# EAGLE design button (EAGLE 7.5.0)

## Sheet 1 of 3: MAIN
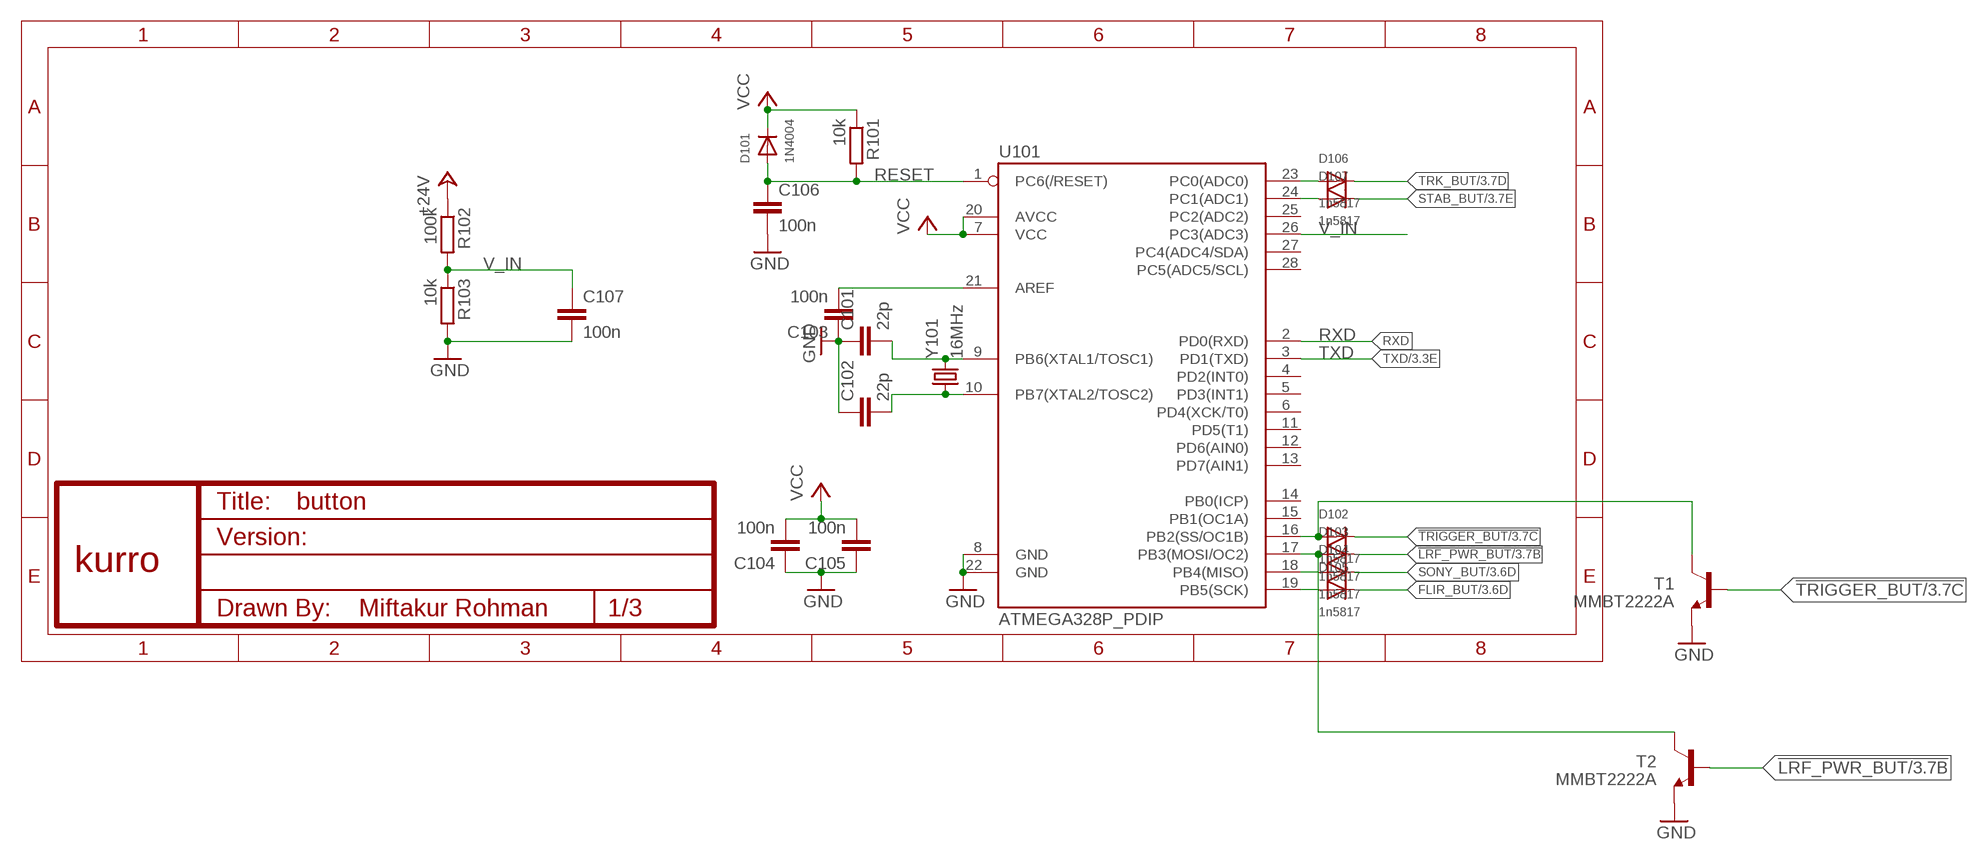
[diagram p0: schematic, sheet 1]

### Parts
C101  22p  C-EUC0603  [C0603]
C102  22p  C-EUC0603  [C0603]
C103  100n  C-EUC0603  [C0603]
C104  100n  C-EUC0603  [C0603]
C105  100n  C-EUC0603  [C0603]
C106  100n  C-EUC0603  [C0603]
C107  100n  C-EUC0603  [C0603]
D101  1N4004  DIODESOD-323F  [SOD-323F]
D102  1n5817  DIODESOD-323F  [SOD-323F]
D103  1n5817  DIODESOD-323F  [SOD-323F]
D104  1n5817  DIODESOD-323F  [SOD-323F]
D105  1n5817  DIODESOD-323F  [SOD-323F]
D106  1n5817  DIODESOD-323F  [SOD-323F]
D107  1n5817  DIODESOD-323F  [SOD-323F]
R101  10k  R-EU_R0603  [R0603]
R102  100k  R-EU_R0603  [R0603]
R103  10k  R-EU_R0603  [R0603]
T1  MMBT2222A  TRANSISTOR_NPNSOT23  [SOT23]
T2  MMBT2222A  TRANSISTOR_NPNSOT23  [SOT23]
U101  ATMEGA328P_PDIP  [DIL28-3]
U$1  KURRO_FOOTPRINT  [KURRO-LOGO]
Y101  16MHz  CRYSTAL-TXC-7A2  [CRYSTAL-TXC-7A2]

### Nets
!LRF_PWR_BUT: D103.C T2.1(B) ; also sheet 3
!TRIGGER_BUT: D102.C T1.1(B) ; also sheet 3
+24V [power]: R102.1 ; also sheet 2,3
FLIR_BUT: D105.C ; also sheet 3
GND: C101.1 C102.1 C103.1 C104.1 C105.1 C106.2 C107.2 R103.2 T1.2(E) T2.2(E) U101.8(GND) U101.22(GND) ; also sheet 2,3
N$7: D104.A U101.18(PB4(MISO))
N$8: D105.A U101.19(PB5(SCK))
N$9: D103.A T2.3(C) U101.17(PB3(MOSI/OC2))
N$10: D106.A U101.23(PC0(ADC0))
N$11: D107.A U101.24(PC1(ADC1))
N$12: D102.A T1.3(C) U101.16(PB2(SS/OC1B))
N$63: C101.2 U101.9(PB6(XTAL1/TOSC1)) Y101.P$2
N$64: C102.2 U101.10(PB7(XTAL2/TOSC2)) Y101.P$1
N$65: C103.2 U101.21(AREF)
RESET: C106.1 D101.A R101.2 U101.1(PC6(/RESET))
RXD: U101.2(PD0(RXD))
SONY_BUT: D104.C ; also sheet 3
STAB_BUT: D107.C ; also sheet 3
TRK_BUT: D106.C ; also sheet 3
TXD: U101.3(PD1(TXD)) ; also sheet 3
V_IN: C107.1 R102.2 R103.1 U101.26(PC3(ADC3))
VCC: C104.2 C105.2 D101.C R101.1 U101.7(VCC) U101.20(AVCC) ; also sheet 2
Unconnected: U101.4(PD2(INT0)) U101.5(PD3(INT1)) U101.6(PD4(XCK/T0)) U101.11(PD5(T1)) U101.12(PD6(AIN0)) U101.13(PD7(AIN1)) U101.14(PB0(ICP)) U101.15(PB1(OC1A)) U101.25(PC2(ADC2)) U101.27(PC4(ADC4/SDA)) U101.28(PC5(ADC5/SCL))

## Sheet 2 of 3: PSU
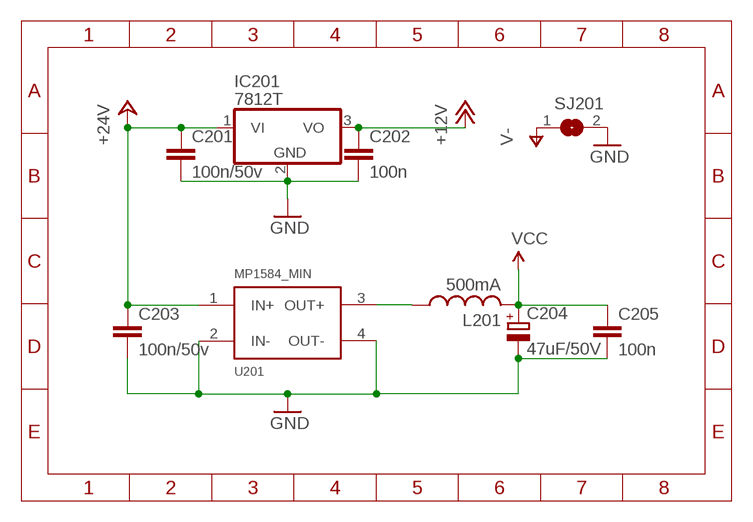
[diagram p1: schematic, sheet 2]

### Parts
C201  100n/50v  C-EUC0603  [C0603]
C202  100n  C-EUC0603  [C0603]
C203  100n/50v  C-EUC0603  [C0603]
C204  47uF/50V  CPOL-EUE2.5-7  [E2,5-7]
C205  100n  C-EUC0603  [C0603]
IC201  7812T  [TO220H]
L201  500mA  L-USL1812  [L1812]
SJ201  SJ  [SJ]
U201  MP1584_MIN  [MP1584_MIN]

### Nets
+12V: C202.1 IC201.3(VO) ; also sheet 3
+24V [power]: C201.1 C203.1 IC201.1(VI) U201.1(IN+) ; also sheet 1,3
GND: C201.2 C202.2 C203.2 C204.- C205.2 IC201.2(GND) SJ201.2 U201.2(IN-) U201.4(OUT-) ; also sheet 1,3
N$1: L201.1 U201.3(OUT+)
V- [power]: SJ201.1 ; also sheet 3
VCC: C204.+ C205.1 L201.2 ; also sheet 1

## Sheet 3 of 3: CONNECTOR
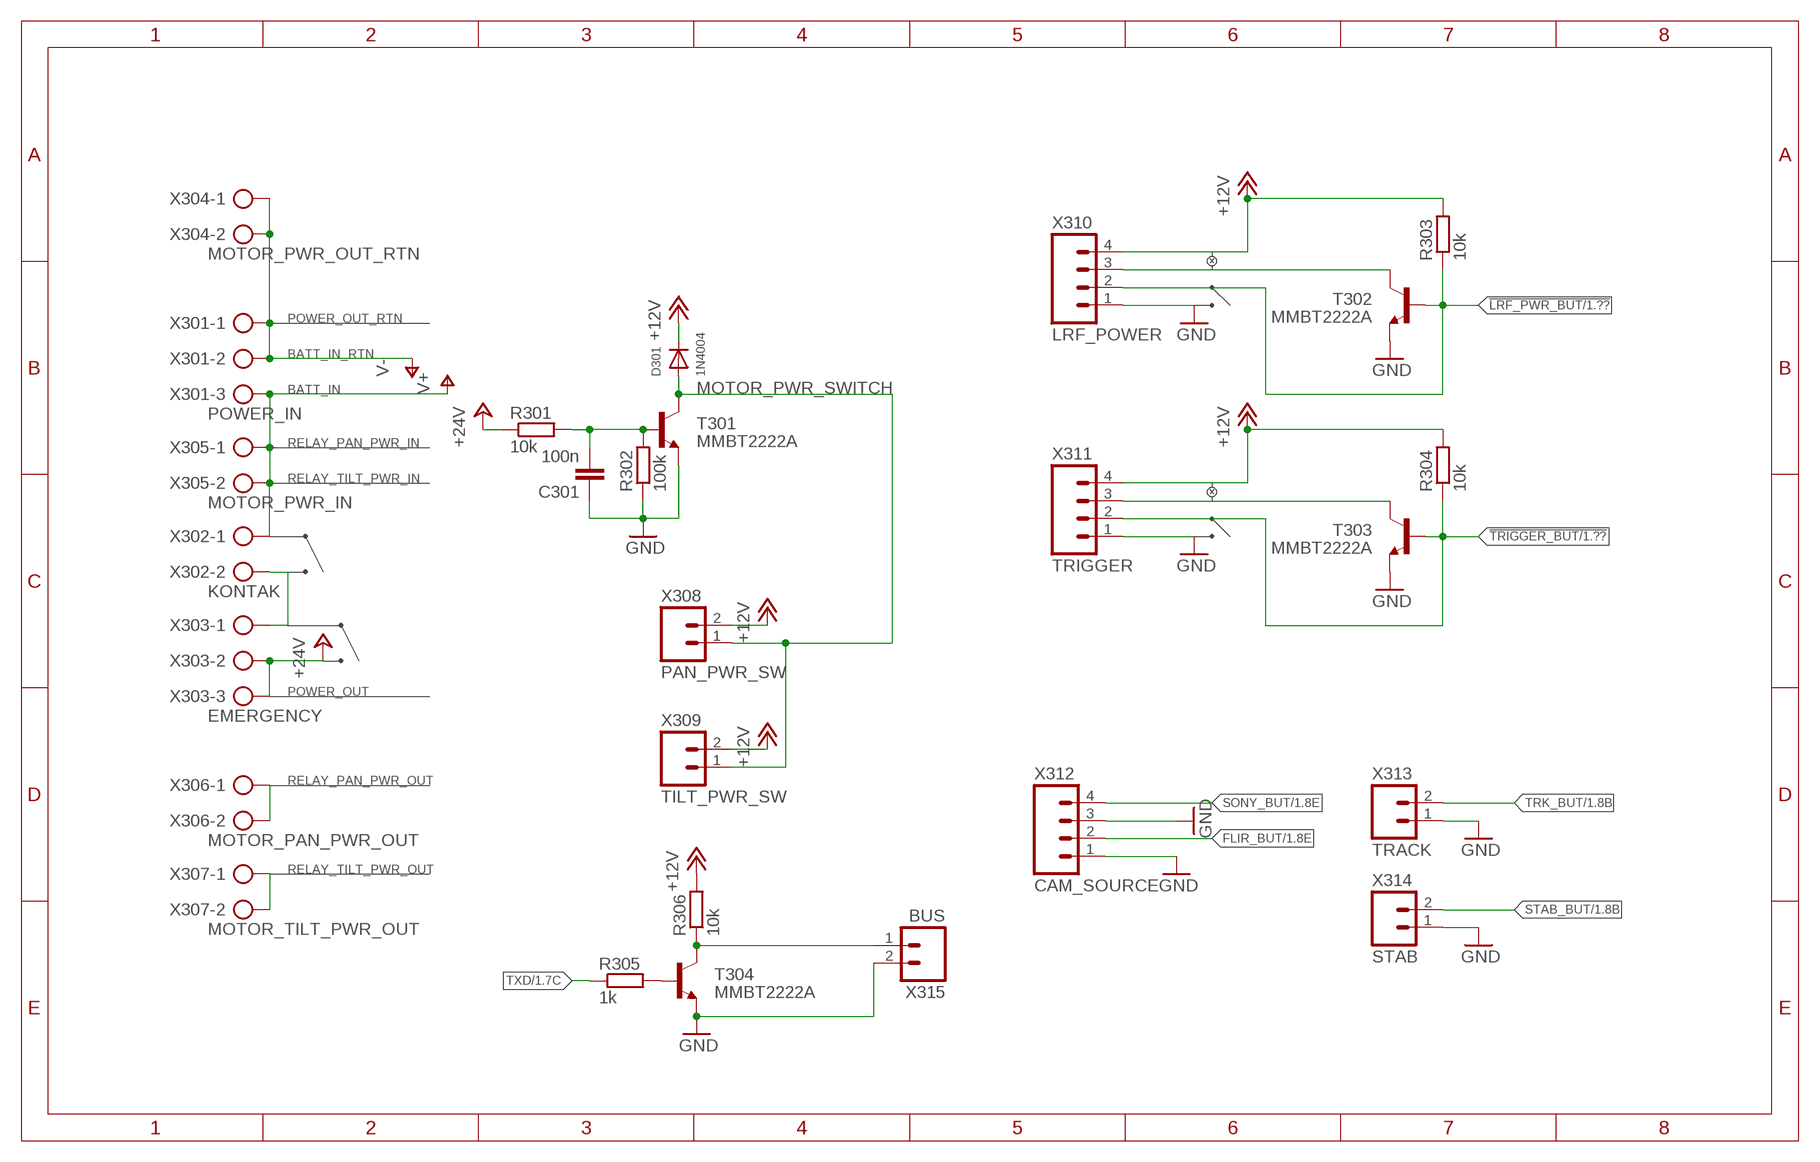
[diagram p2: schematic, sheet 3]

### Parts
C301  100n  C-EUC0603  [C0603]
D301  1N4004  DIODESOD-323F  [SOD-323F]
R301  10k  R-EU_R0603  [R0603]
R302  100k  R-EU_R0603  [R0603]
R303  10k  R-EU_R0603  [R0603]
R304  10k  R-EU_R0603  [R0603]
R305  1k  R-EU_R0603  [R0603]
R306  10k  R-EU_R0603  [R0603]
T301  MMBT2222A  TRANSISTOR_NPNSOT23  [SOT23]
T302  MMBT2222A  TRANSISTOR_NPNSOT23  [SOT23]
T303  MMBT2222A  TRANSISTOR_NPNSOT23  [SOT23]
T304  MMBT2222A  TRANSISTOR_NPNSOT23  [SOT23]
X301  POWER_IN  AK300/3  [AK300/3]
X302  KONTAK  AK300/2  [AK300/2]
X303  EMERGENCY  AK300/3  [AK300/3]
X304  MOTOR_PWR_OUT_RTN  AK300/2  [AK300/2]
X305  MOTOR_PWR_IN  AK300/2  [AK300/2]
X306  MOTOR_PAN_PWR_OUT  AK300/2  [AK300/2]
X307  MOTOR_TILT_PWR_OUT  AK300/2  [AK300/2]
X308  PAN_PWR_SW  M02JST-PTH-VERT  [JST-2-PTH-VERT]
X309  TILT_PWR_SW  M02JST-PTH-VERT  [JST-2-PTH-VERT]
X310  LRF_POWER  M04JST-PTH-VERT  [JST-4-PTH-VERT]
X311  TRIGGER  M04JST-PTH-VERT  [JST-4-PTH-VERT]
X312  CAM_SOURCE  M04JST-PTH-VERT  [JST-4-PTH-VERT]
X313  TRACK  M02JST-PTH-VERT  [JST-2-PTH-VERT]
X314  STAB  M02JST-PTH-VERT  [JST-2-PTH-VERT]
X315  BUS  M02JST-PTH-VERT  [JST-2-PTH-VERT]

### Nets
!LRF_PWR_BUT: R303.1 T302.1(B) X310.2 ; also sheet 1
!TRIGGER_BUT: R304.1 T303.1(B) X311.2 ; also sheet 1
+12V: D301.C R303.2 R304.2 R306.2 X308.2 X309.2 X310.4 X311.4 ; also sheet 2
+24V [power]: R301.1 X303.2 X303.3 ; also sheet 1,2
BUS1: R306.1 T304.3(C) X315.1
FLIR_BUT: X312.2 ; also sheet 1
GND: C301.1 R302.1 T301.2(E) T302.2(E) T303.2(E) T304.2(E) X310.1 X311.1 X312.1 X312.3 X313.1 X314.1 X315.2 ; also sheet 1,2
KONTAK_EMER_JUNCTION [power]: X302.2 X303.1
MOTOR_PWR_SWITCH: D301.A T301.3(C) X308.1 X309.1
N$2: C301.2 R301.2 R302.2 T301.1(B)
N$3 [power]: X306.1 X306.2
N$4 [power]: X307.1 X307.2
N$5: T303.3(C) X311.3
N$6: T302.3(C) X310.3
N$15: R305.2 T304.1(B)
SONY_BUT: X312.4 ; also sheet 1
STAB_BUT: X314.2 ; also sheet 1
TRK_BUT: X313.2 ; also sheet 1
TXD: R305.1 ; also sheet 1
V+ [power]: X301.3 X302.1 X305.1 X305.2
V- [power]: X301.1 X301.2 X304.1 X304.2 ; also sheet 2

### Notes on the sheet
- POWER_OUT_RTN
- BATT_IN_RTN
- BATT_IN
- RELAY_PAN_PWR_IN
- RELAY_TILT_PWR_IN
- POWER_OUT
- RELAY_PAN_PWR_OUT
- RELAY_TILT_PWR_OUT

## Library data of the parts
C101-C107 C201-C203 C205 C301 = rcl:C-EU: CAPACITOR, European symbol
C204 = rcl:CPOL-EU: POLARIZED CAPACITOR, European symbol
D101-D107 D301 = adafruit:DIODE: Diode SMADIODE - SMA Surface Mount Package 20V 1A Schottky Diode Digikey: 641-1014-6-ND DO-1N4148 - Through Hole Small Current Diode SOD-123 20V 1 A (.5mV Vf) Schottky Diode - Digikey: MBRX120TPMSCT-ND SOD-323 10V 570mA (.38mV Vf, 3ns) Schottky Diode - Digikey: ZLLS410CT-ND SOD-523 30V 30mA Schottky Diode (RB751S-40TE61) - Digikey: RB751S-40TE61CT-ND SOT23-R/W - SOT23 Package (R = Solder Paste/Reflow Ovens, W = Hand-Soldering) BAT54Film 40V 300mA - Digikey: 497-7162-1-ND
IC201 = adafruit:78*: Positive VOLTAGE REGULATOR Added bigger pads to the TO-92 package
L201 = rcl:L-US: INDUCTOR, American symbol
R101-R103 R301-R306 = rcl:R-EU_: RESISTOR, European symbol
SJ201 = jumper:SJ: SMD solder JUMPER
T1 T2 T301-T304 = SparkFun-DiscreteSemi:TRANSISTOR_NPN: Generic NPN BJT MMBT2222A - TRANS-08049 (SOT-23, 1A 40V) MPSA42 - TRANS-09116 (SOT-23, 500mA 300V) MMBT5088LT1G - TRANS-11160 (SOT-23, 50 mA 30V)
U101 = SparkFun-DigitalIC:ATMEGA328P_PDIP: uC used in the Arduino 32kb flash, 1k EEPROM, 2k SRAM This is the through-hole version of this chip.
U201 = SparkFun-Boards:MP1584
U$1 = SparkFun:KURRO_FOOTPRINT
X301 X303 = con-ptr500:AK300/3: CONNECTOR; OC_FARNELL: unknown; OC_NEWARK: unknown
X302 X304-X307 = con-ptr500:AK300/2: CONNECTOR; OC_FARNELL: unknown; OC_NEWARK: unknown
X308 X309 X313-X315 = SparkFun-Connectors:M02: Standard 2-pin 0.1" header. Use with - straight break away headers ( PRT-00116) - right angle break away headers (PRT-00553) - swiss pins (PRT-00743) - machine pins (PRT-00117) - female headers (PRT-00115) Molex polarized connector foot print use with: PRT-08233 with associated crimp pins and housings. 2.54_SCREWTERM for use with PRT-10571. 3.5mm Screw Terminal footprints for PRT-08084 5mm Screw Terminal footprints for use with PRT-08433
X310-X312 = SparkFun-Connectors:M04: Header 4 Standard 4-pin 0.1" header. Use with straight break away headers (SKU : PRT-00116), right angle break away headers (PRT-00553), swiss pins (PRT-00743), machine pins (PRT-00117), and female headers (PRT-00115). Molex polarized connector foot print use with SKU : PRT-08231 with associated crimp pins and housings. 1MM SMD Version SKU: PRT-10208
Y101 = SparkFun-FreqCtrl:CRYSTAL: Various standard crystals. Proven footprints.

## Net classes
0 default: width 0.254 mm, drill 0.59 mm, clearance 0.254 mm
1 power: width 0.406 mm, drill 0.8 mm, clearance 0.406 mm

## Board
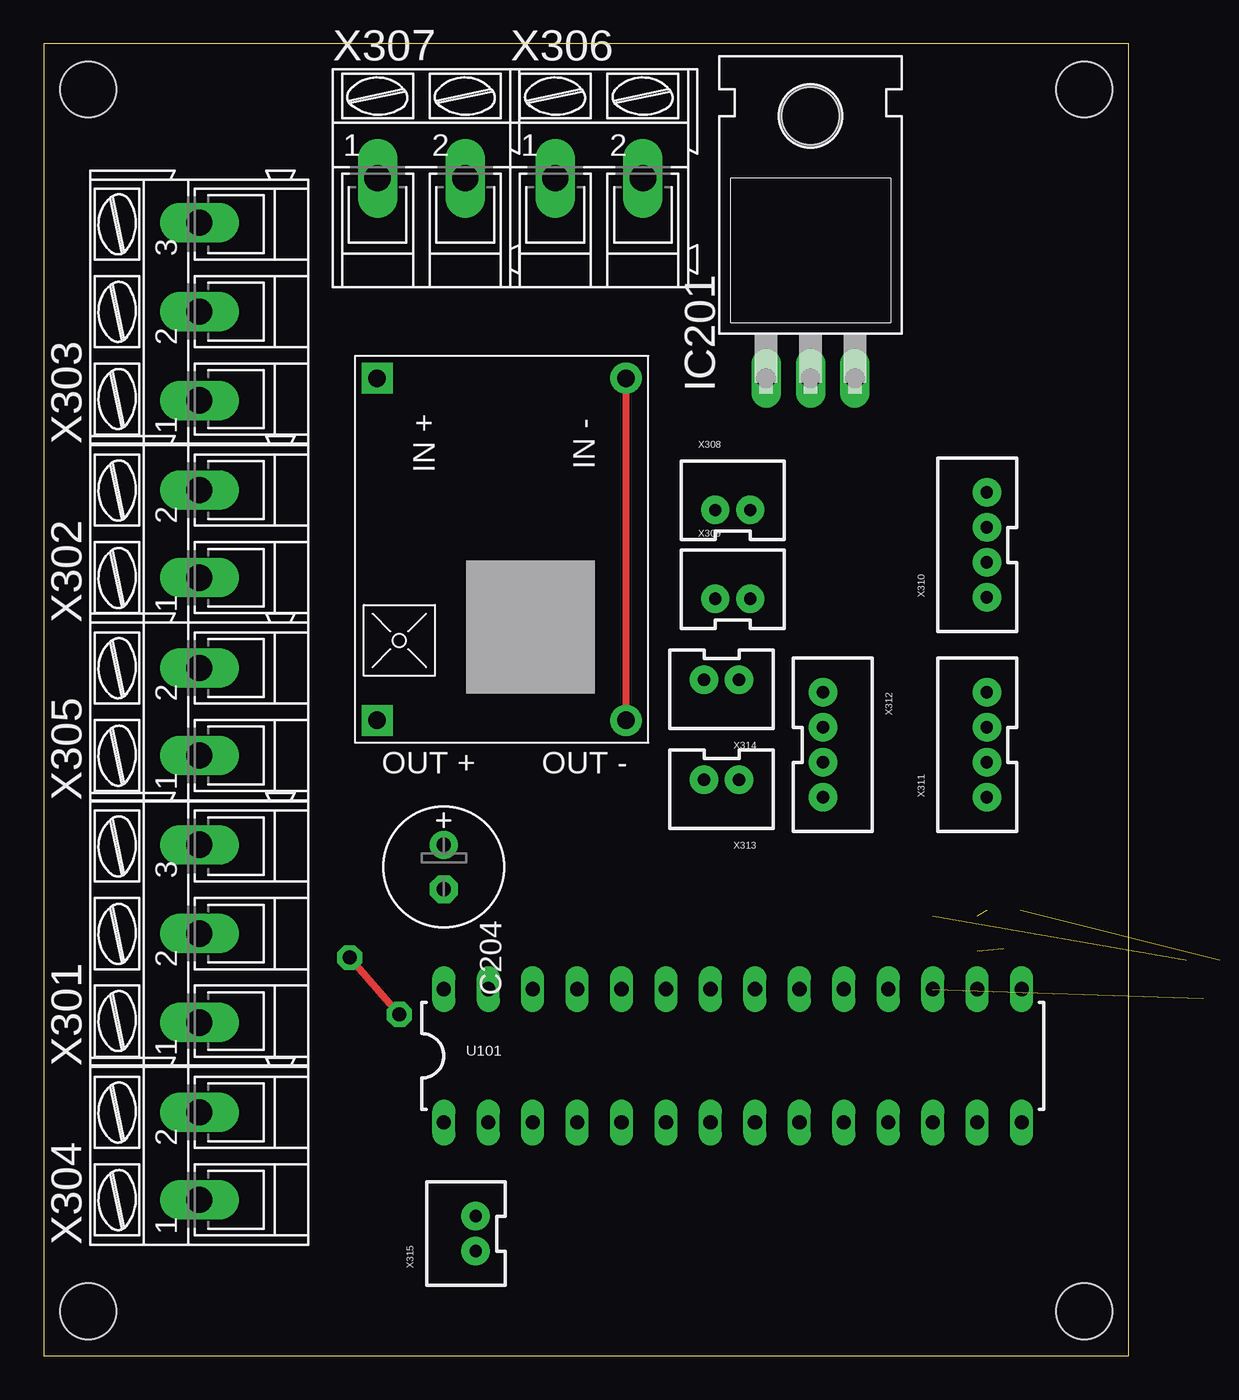
[diagram p3: board, top side]
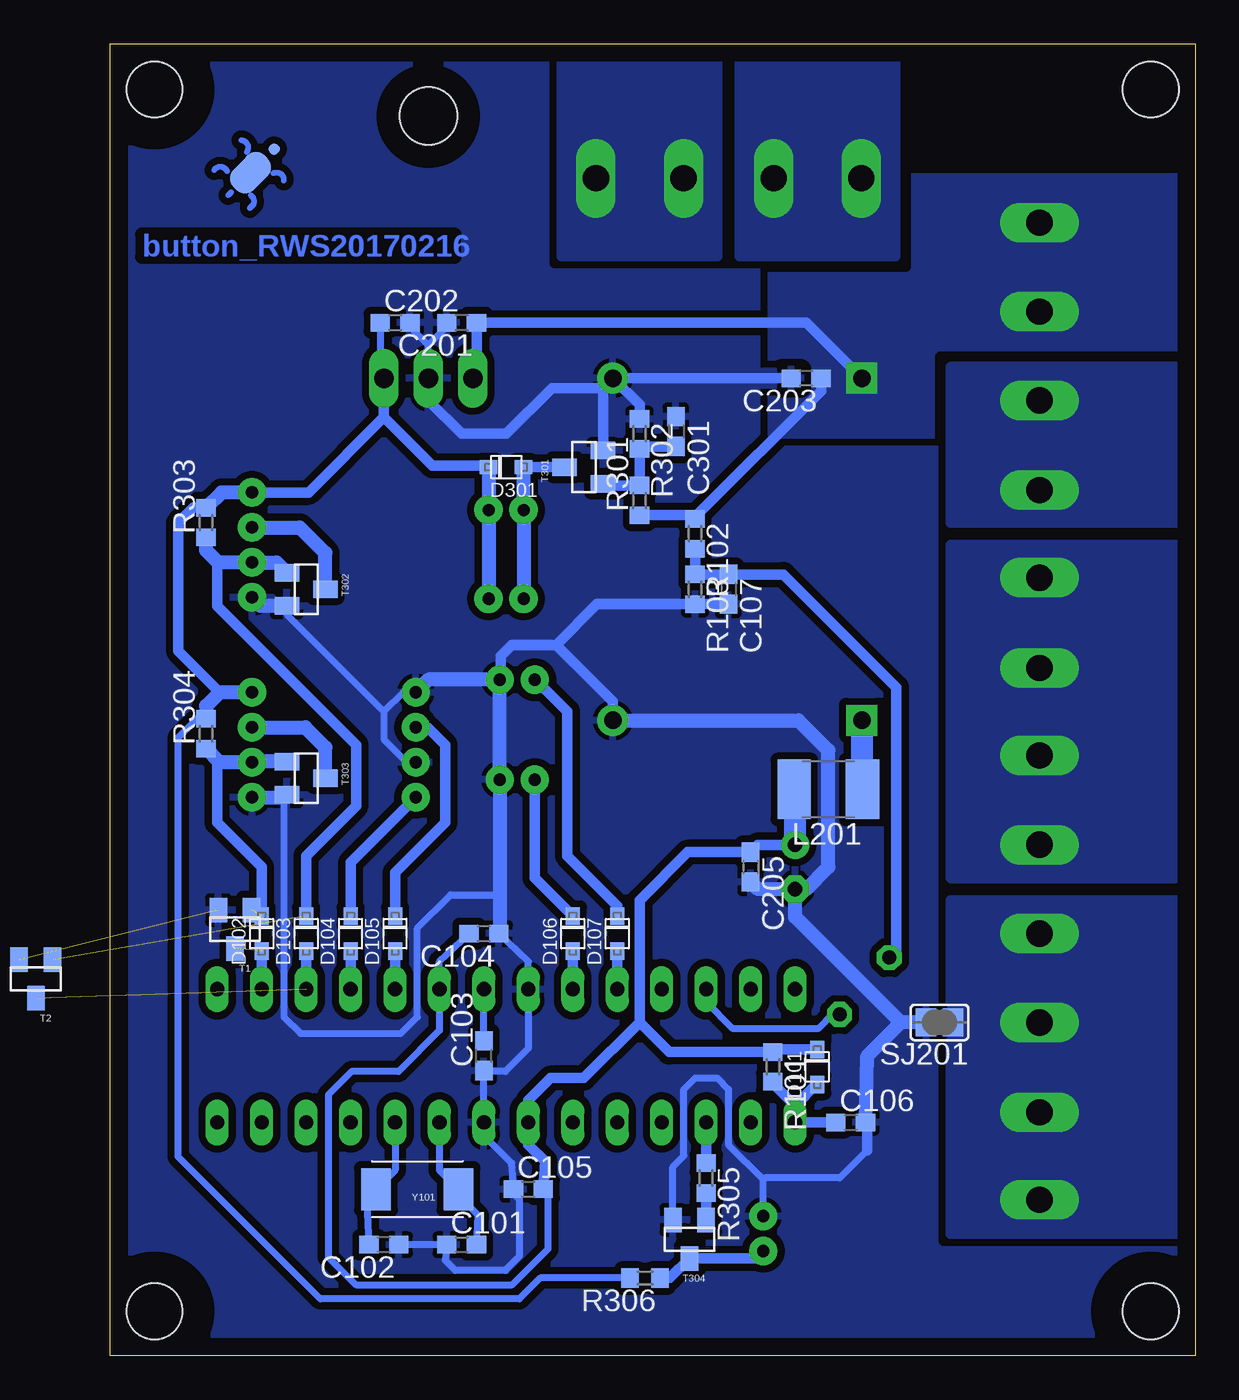
[diagram p4: board, bottom side, seen from below]

Size 62 x 75 mm. Coordinates in mm from the lower left corner, seen from the top.
Outline: 0,0 62,0 62,75 0,75 0,0
Copper layers (1*16): Top 0.035mm / dielectric 1.5mm / Bottom 0.035mm
Design rules "default": minimum track width 10mil, minimum drill 24mil, track to track 8mil, track to pad 8mil, pad to pad 8mil, via to via 8mil, smd to smd 8mil, copper to edge 40mil, drill to drill 8mil, minimum pad ring 10mil, minimum via ring 8mil, stop-mask expansion 4mil, vias tented up to drill 0mil, thermal gap 10mil
Holes 3.2 mm at 2.54,2.54 2.54,72.39 59.46,2.54 59.46,72.39
bRestrict: area -0.5,-0.5 to 5.5,5.5; area -0.5,69.4 to 5.5,75.4; area 56.5,-0.5 to 62.5,5.5; area 56.5,69.4 to 62.5,75.4

### Footprints (pad centres in the part's own frame; a part is rotated, then mirrored left to right if it is on the bottom)
C0603 = smd 1.1 x 1: 1 -0.85,0; 2 0.85,0
E2,5-7 = drill 0.813 pad 1.6: + -1.27,0 | drill 0.813 pad 1.6 octagon: - 1.27,0
SOD-323F = smd 1 x 0.8: A -1,0; C 1,0
TO220H = drill 1.118 long: 1 -2.54,-10.16; 2 0,-10.16; 3 2.54,-10.16 | hole 3.302: 0,4.826
L1812 = smd 1.9 x 3.4: 1 -1.95,0; 2 1.95,0
R0603 = smd 1 x 1.1: 1 -0.85,0; 2 0.85,0
SJ = smd 1.168 x 1.6: 1 -0.762,0; 2 0.762,0
SOT23 = smd 1 x 1.4: 1 -0.95,-1.1; 2 0.95,-1.1; 3 0,1.1
DIL28-3 = drill 0.813 long: 1 -16.51,-3.81; 2 -13.97,-3.81; 3 -11.43,-3.81; 4 -8.89,-3.81; 5 -6.35,-3.81; 6 -3.81,-3.81; 7 -1.27,-3.81; 8 1.27,-3.81; 9 3.81,-3.81; 10 6.35,-3.81; 11 8.89,-3.81; 12 11.43,-3.81; 13 13.97,-3.81; 14 16.51,-3.81; 15 16.51,3.81; 16 13.97,3.81; 17 11.43,3.81; 18 8.89,3.81; 19 6.35,3.81; 20 3.81,3.81; 21 1.27,3.81; 22 -1.27,3.81; 23 -3.81,3.81; 24 -6.35,3.81; 25 -8.89,3.81; 26 -11.43,3.81; 27 -13.97,3.81; 28 -16.51,3.81
MP1584_MIN = drill 1 pad 1.778 square: 1 1.27,1.27; 3 20.83,1.27 | drill 1 pad 1.778: 2 1.27,15.49; 4 20.83,15.49
KURRO-LOGO = smd 2.54 x 1.651 rotated 45 bottom: P$1 0,0 | smd 0.635 x 0.635 rotated 45 bottom: P$2 1.347,1.347
AK300/3 = drill 1.5 long: 1 -5.08,0; 2 0,0; 3 5.08,0
AK300/2 = drill 1.5 long: 1 -2.515,0; 2 2.489,0
JST-2-PTH-VERT = drill 0.7 pad 1.626: 1 -1,-0.55; 2 1,-0.55
JST-4-PTH-VERT = drill 0.7 pad 1.626: 1 -3,-0.55; 2 -1,-0.55; 3 1,-0.55; 4 3,-0.55
CRYSTAL-TXC-7A2 = smd 1.7 x 2.4: P$1 2.358,0; P$2 -2.358,0

### Placement (x,y rotation side)
C101  41.91,6.35 0 bottom
C102  46.35,6.35 180 bottom
C103  40.64,17.14 90 bottom
C104  40.64,24.13 180 bottom
C105  38.1,9.53 0 bottom
C106  19.68,13.34 0 bottom
C107  26.67,43.81 270 bottom
C201  41.91,59.05 180 bottom
C202  45.72,59.05 0 bottom
C203  22.23,55.88 180 bottom
C204  22.86,27.94 270 top
C205  25.4,27.94 270 bottom
C301  29.67,52.83 270 bottom
D101  21.59,16.51 90 bottom
D102  53.34,24.13 90 bottom
D103  50.8,24.13 90 bottom
D104  48.26,24.13 90 bottom
D105  45.72,24.13 90 bottom
D106  35.56,24.13 90 bottom
D107  33.02,24.13 90 bottom
D301  39.37,50.8 180 bottom
IC201  43.81,66.04 0 top
L201  20.95,32.38 180 bottom
R101  24.13,16.51 270 bottom
R102  28.57,46.99 270 bottom
R103  28.57,43.81 270 bottom
R301  31.75,48.9 90 bottom
R302  31.75,52.7 270 bottom
R303  56.52,47.62 90 bottom
R304  56.52,35.56 90 bottom
R305  27.94,10.16 270 bottom
R306  31.43,4.45 180 bottom
SJ201  14.61,19.05 180 bottom
T1  54.86,24.38 180 bottom
T2  66.24,21.54 180 bottom  (outside the outline)
T301  34.92,50.8 90 bottom
T302  50.8,43.81 270 bottom
T303  50.8,33.02 270 bottom
T304  28.89,6.67 180 bottom
U101  39.37,17.14 0 top
U201  17.78,57.15 270 top
U$1  53.98,67.63 90 top
X301  8.89,24.13 90 top
X302  8.89,46.99 90 top
X303  8.89,59.69 90 top
X304  8.89,11.43 90 top
X305  8.89,36.83 90 top
X306  31.75,67.31 0 top
X307  21.59,67.31 0 top
X308  39.37,48.9 0 top
X309  39.37,43.81 0 top
X310  53.34,46.35 90 top
X311  53.34,34.92 90 top
X312  45.09,34.92 270 top
X313  38.73,32.38 180 top
X314  38.73,38.1 180 top
X315  24.13,6.99 90 top
Y101  44.45,9.53 180 bottom

### Tracks (layer width: path | path; a pad name or v marks a point on that pad's centre or on a via)
!LRF_PWR_BUT  (1 unrouted)
  Bottom 0.61: D103.C 50.8,28.57 47.94,31.43 47.94,34.92 55.88,42.86 55.88,45.31 55.83,45.35
  Bottom 0.813: T302.1 52.49,45.35 X310.2 55.83,45.35 56.52,46.04 R303.1
!TRIGGER_BUT  (1 unrouted)
  Bottom 0.61: D102.C 53.34,27.94 55.88,30.48 55.88,33.77 55.73,33.92
  Bottom 0.813: T303.1 53.84,33.97 X311.2 55.73,33.92 R304.1
+12V
  Bottom 0.406: C202.1 46.57,56.09 IC201.3 | R306.2 37.41,4.45 38.61,3.25 49.99,3.25 58.12,11.38 58.12,35.36 57.06,36.41 R304.2
  Bottom 0.61: IC201.3 46.35,53.66 | 46.35,53.66 43.58,50.88 40.45,50.88 D301.C | X310.4 50.66,49.35 46.35,53.66 | R303.2 57.25,48.48 58.1,47.62 58.1,40.29 55.74,37.92
  Bottom 0.813: D301.C X308.2 X309.2 | X310.4 55.63,49.35 R303.2 | X311.4 55.74,37.92 56.52,37.15 R304.2
+24V
  Bottom 0.61: C203.1 21.38,55.14 28.47,48.05 | R301.1 28.47,48.05 | U201.1 22.23,59.05 C201.1 41.06,56.09 IC201.1 | 28.47,48.05 28.47,47.94 R102.1
  pour Bottom (isolate 0.61, rank 2, no thermals): 0,52.7 24.13,52.7 24.13,67.31 0,67.31
BUS1
  Bottom 0.61: X315.1 25.1,5.57 T304.3 30.02,4.45 R306.1
FLIR_BUT
  Bottom 0.61: D105.C 45.72,27.62 42.86,30.48 42.86,34.92 43.81,35.88 44.49,35.88 X312.2
GND  (1 unrouted)
  Top 0.406: U201.2 U201.4
  Bottom 0.406: C102.1 C101.1 42.86,5.47 42.27,4.88 39.42,4.88 38.61,5.69 38.61,8.94 39.05,9.38 C105.1 39.05,11.01 40.64,12.6 U101.8 C103.1 40.58,16.26 39.42,16.26 38.1,17.58 U101.22 38.1,22.54 C104.1 | IC201.2 43.81,57.78 | C202.2 44.87,58.84 43.81,57.78 | C201.2 42.76,58.84 43.81,57.78 | X312.1 45.26,37.92 46.35,36.83 | 46.35,36.83 46.35,35.24 45.04,33.92 X312.3 | T302.2 51.9,42.38 46.35,36.83 | T303.2 51.9,31.92 52.07,31.75 52.07,19.37 51.12,18.41 45.4,18.41 44.45,19.37 44.45,24.45 42.55,26.35 39.73,26.35 | T304.2 29.84,10.8 29.21,11.43 29.21,15.24 28.57,15.88 27.3,15.88 26.67,15.24 26.67,12.06 24.68,10.07 | X315.2 24.68,10.07 | 18.73,11.75 20.32,10.16 24.59,10.16 24.68,10.07
  Bottom 0.61: C203.2 U201.2 | T301.2 33.83,55.33 | 33.83,55.33 U201.2 | R302.1 31.75,54.36 U201.2 | 33.83,55.33 36.75,55.33 39.37,52.7 41.91,52.7 43.81,54.61 IC201.2 | 18.73,11.75 18.73,13.33 C106.2 | U201.4 33.27,37.4 36.51,40.64 | 36.51,40.64 39.05,40.64 39.69,40.01 39.69,38.7 X314.1 | C107.2 R103.2 34.19,42.97 36.51,40.64
  Bottom 0.813: C204.- 22.23,26.67 20.95,27.94 20.95,34.61 22.67,36.32 U201.4 | C204.- 24.98,26.67 C205.2 | SJ201.2 16.83,19.05 | 16.83,19.05 22.86,25.08 C204.- | C106.2 18.73,17.14 16.83,19.05 | T302.2 53.4,42.87 X310.1 | X311.1 52.05,31.93 T303.2 | X312.1 43.81,38.65 X314.1 X313.1 39.73,26.35 39.73,24.18 C104.1
  pour Bottom (isolate 0.406, rank 6): 0,0 62.23,0 62.23,74.93 0,74.93
KONTAK_EMER_JUNCTION
  pour Bottom (isolate 0.61, no thermals): 0,47.62 13.97,47.62 13.97,56.52 0,56.52
MOTOR_PWR_SWITCH
  Bottom 0.61: T301.3 D301.A
  Bottom 0.813: 38.28,48.26 X308.1 | X308.1 D301.A | X308.1 X309.1
N$1
  Bottom 1.27: U201.3 19.05,32.43 L201.1
N$2
  Bottom 0.61: C301.2 31.62,51.98 R302.2 R301.2 33.72,49.74
  Bottom 0.813: 33.72,49.74 T301.1
N$3
  pour Bottom (isolate 0.61, no thermals): 27.3,74.93 36.2,74.93 36.2,62.87 27.3,62.87
N$4
  pour Bottom (isolate 0.61, no thermals): 17.14,74.93 26.04,74.93 26.04,62.87 17.14,62.87
N$5
  Bottom 0.813: X311.3 50.85,35.92 49.7,34.78 T303.3
N$6
  Bottom 0.813: X310.3 51.16,47.35 49.7,45.89 T302.3
N$7
  Bottom 0.61: U101.18 D104.A
N$8
  Bottom 0.61: U101.19 D105.A
N$9  (1 unrouted)
  Bottom 0.61: U101.17 D103.A
N$10
  Bottom 0.61: U101.23 D106.A
N$11
  Bottom 0.61: U101.24 D107.A
N$12  (1 unrouted)
  Bottom 0.61: U101.16 D102.A
N$15
  Bottom 0.61: R305.2 T304.1
N$63
  Bottom 0.406: U101.9 43.18,10.61 Y101.P$2 41.86,9.29 41.86,8.94 40.96,8.04 C101.2
N$64
  Bottom 0.406: U101.10 45.72,10.61 Y101.P$1 47.14,9.19 47.14,8.94 47.3,8.78 C102.2
N$65
  Bottom 0.406: C103.2 U101.21
RESET
  Bottom 0.61: C106.1 U101.1 22.86,14.29 | D101.A 21.64,15.51 22.86,14.29 | R101.2 24.13,15.56 22.86,14.29
SONY_BUT
  Bottom 0.61: D104.C 48.26,28.2 X312.4
STAB_BUT
  Bottom 0.61: X314.2 37.7,38.65 35.88,36.83 35.88,28.57 33.02,25.72 D107.C
TRK_BUT
  Bottom 0.61: X313.2 37.73,27.3 D106.C
TXD
  Bottom 0.61: U101.3 R305.1
V+
  pour Bottom (isolate 0.61, no thermals): 0,27.3 13.97,27.3 13.97,46.35 0,46.35
V-
  pour Bottom (isolate 0.61, no thermals): 0,6.99 13.97,6.99 13.97,26.04 0,26.04
V_IN  (via drill 0.8 pad 1.42)
  Top 0.406: v17.48,22.76 v20.32,19.51
  Bottom 0.406: v20.32,19.51 20.73,19.51 21.54,18.69 26.42,18.69 27.94,20.22 U101.26
  Bottom 0.61: R102.2 R103.1 C107.1 23.53,44.66 17.07,38.2 17.07,23.16 v17.48,22.76
VCC
  Bottom 0.406: C104.2 43.18,22.54 U101.20 43.18,18.59 45.52,16.26 48.2,16.26 49.53,14.92 49.53,5.64 47.95,4.06 39.01,4.06 36.98,6.1 36.98,9.36 C105.2
  Bottom 0.61: C204.+ 24.98,29.21 C205.1 29,28.79 31.75,26.04 31.75,19.05 | 31.75,19.05 34.92,15.88 36.83,15.88 38.1,14.61 U101.7 38.1,12.06 37.15,11.12 C105.2 | D101.C 23.98,17.51 R101.1 30.06,17.36 31.75,19.05
  Bottom 1.27: C204.+ 22.86,32.34 L201.2

### Text on the board
Bottom: button_RWS20170216